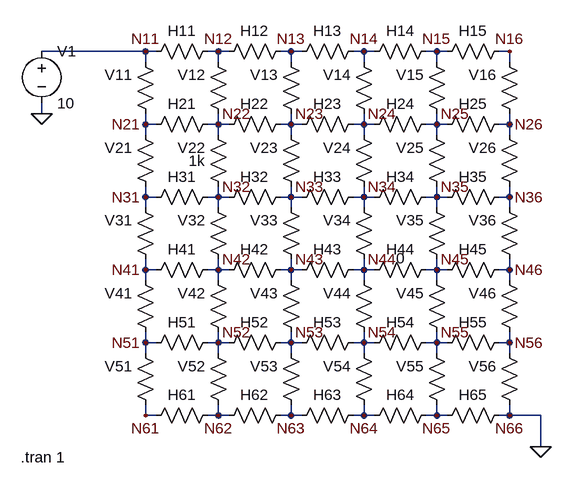
[diagram p0: schematic 6x6_grid.asc]
6x6_grid.asc, the LTspice schematic file:
Version 4
SHEET 1 880 732
WIRE -16 96 -176 96
WIRE 0 96 -16 96
WIRE 96 96 80 96
WIRE 112 96 96 96
WIRE 208 96 192 96
WIRE 224 96 208 96
WIRE 320 96 304 96
WIRE 336 96 320 96
WIRE 432 96 416 96
WIRE 448 96 432 96
WIRE 544 96 528 96
WIRE -16 112 -16 96
WIRE 96 112 96 96
WIRE 208 112 208 96
WIRE 320 112 320 96
WIRE 432 112 432 96
WIRE 544 112 544 96
WIRE -176 192 -176 176
WIRE -16 208 -16 192
WIRE 0 208 -16 208
WIRE 96 208 96 192
WIRE 96 208 80 208
WIRE 112 208 96 208
WIRE 208 208 208 192
WIRE 208 208 192 208
WIRE 224 208 208 208
WIRE 320 208 320 192
WIRE 320 208 304 208
WIRE 336 208 320 208
WIRE 432 208 432 192
WIRE 432 208 416 208
WIRE 448 208 432 208
WIRE 544 208 544 192
WIRE 544 208 528 208
WIRE -16 224 -16 208
WIRE 96 224 96 208
WIRE 208 224 208 208
WIRE 320 224 320 208
WIRE 432 224 432 208
WIRE 544 224 544 208
WIRE -16 320 -16 304
WIRE 0 320 -16 320
WIRE 96 320 96 304
WIRE 96 320 80 320
WIRE 112 320 96 320
WIRE 208 320 208 304
WIRE 208 320 192 320
WIRE 224 320 208 320
WIRE 320 320 320 304
WIRE 320 320 304 320
WIRE 336 320 320 320
WIRE 432 320 432 304
WIRE 432 320 416 320
WIRE 448 320 432 320
WIRE 544 320 544 304
WIRE 544 320 528 320
WIRE -16 336 -16 320
WIRE 96 336 96 320
WIRE 208 336 208 320
WIRE 320 336 320 320
WIRE 432 336 432 320
WIRE 544 336 544 320
WIRE -16 432 -16 416
WIRE 0 432 -16 432
WIRE 96 432 96 416
WIRE 96 432 80 432
WIRE 112 432 96 432
WIRE 208 432 208 416
WIRE 208 432 192 432
WIRE 224 432 208 432
WIRE 320 432 320 416
WIRE 320 432 304 432
WIRE 336 432 320 432
WIRE 432 432 432 416
WIRE 432 432 416 432
WIRE 448 432 432 432
WIRE 544 432 544 416
WIRE 544 432 528 432
WIRE -16 448 -16 432
WIRE 96 448 96 432
WIRE 208 448 208 432
WIRE 320 448 320 432
WIRE 432 448 432 432
WIRE 544 448 544 432
WIRE -16 544 -16 528
WIRE 0 544 -16 544
WIRE 96 544 96 528
WIRE 96 544 80 544
WIRE 112 544 96 544
WIRE 208 544 208 528
WIRE 208 544 192 544
WIRE 224 544 208 544
WIRE 320 544 320 528
WIRE 320 544 304 544
WIRE 336 544 320 544
WIRE 432 544 432 528
WIRE 432 544 416 544
WIRE 448 544 432 544
WIRE 544 544 544 528
WIRE 544 544 528 544
WIRE -16 560 -16 544
WIRE 96 560 96 544
WIRE 208 560 208 544
WIRE 320 560 320 544
WIRE 432 560 432 544
WIRE 544 560 544 544
WIRE -16 656 -16 640
WIRE 0 656 -16 656
WIRE 96 656 96 640
WIRE 96 656 80 656
WIRE 112 656 96 656
WIRE 208 656 208 640
WIRE 208 656 192 656
WIRE 224 656 208 656
WIRE 320 656 320 640
WIRE 320 656 304 656
WIRE 336 656 320 656
WIRE 432 656 432 640
WIRE 432 656 416 656
WIRE 448 656 432 656
WIRE 544 656 544 640
WIRE 544 656 528 656
WIRE 592 656 544 656
WIRE 592 704 592 656
FLAG -16 96 N11
FLAG 96 96 N12
FLAG 208 96 N13
FLAG 320 96 N14
FLAG -16 208 N21
FLAG 96 208 N22
FLAG 208 208 N23
FLAG 320 208 N24
FLAG -16 320 N31
FLAG 96 320 N32
FLAG 208 320 N33
FLAG 320 320 N34
FLAG -16 432 N41
FLAG -16 544 N51
FLAG -16 656 N61
FLAG 96 432 N42
FLAG 96 656 N62
FLAG 208 432 N43
FLAG 208 656 N63
FLAG 320 656 N64
FLAG 592 704 0
FLAG 432 96 N15
FLAG 544 96 N16
FLAG 432 208 N25
FLAG 544 208 N26
FLAG 432 320 N35
FLAG 544 320 N36
FLAG 320 432 N44
FLAG 432 432 N45
FLAG 544 432 N46
FLAG 432 544 N55
FLAG 544 544 N56
FLAG 432 656 N65
FLAG 544 656 N66
FLAG 96 544 N52
FLAG 208 544 N53
FLAG 320 544 N54
FLAG -176 192 0
SYMBOL res 96 80 R90
WINDOW 0 0 56 VBottom 2
WINDOW 3 20 56 Invisible 2
SYMATTR InstName H11
SYMATTR Value 1k
SYMBOL res 208 80 R90
WINDOW 0 0 56 VBottom 2
WINDOW 3 20 56 Invisible 2
SYMATTR InstName H12
SYMATTR Value 1k
SYMBOL res 320 80 R90
WINDOW 0 0 56 VBottom 2
WINDOW 3 20 56 Invisible 2
SYMATTR InstName H13
SYMATTR Value 1k
SYMBOL res 0 208 R180
WINDOW 0 36 76 Left 2
WINDOW 3 36 56 Invisible 2
SYMATTR InstName V11
SYMATTR Value 1k
SYMBOL res 112 208 R180
WINDOW 0 36 76 Left 2
WINDOW 3 36 56 Invisible 2
SYMATTR InstName V12
SYMATTR Value 1k
SYMBOL res 224 208 R180
WINDOW 0 36 76 Left 2
WINDOW 3 36 56 Invisible 2
SYMATTR InstName V13
SYMATTR Value 1k
SYMBOL res 336 208 R180
WINDOW 0 36 76 Left 2
WINDOW 3 36 56 Invisible 2
SYMATTR InstName V14
SYMATTR Value 1k
SYMBOL res 0 320 R180
WINDOW 0 36 76 Left 2
WINDOW 3 36 56 Invisible 2
SYMATTR InstName V21
SYMATTR Value 1k
SYMBOL res -16 336 R270
WINDOW 0 32 56 VTop 2
WINDOW 3 12 56 Invisible 2
SYMATTR InstName H31
SYMATTR Value 1k
SYMBOL res 96 336 R270
WINDOW 0 32 56 VTop 2
WINDOW 3 12 56 Invisible 2
SYMATTR InstName H32
SYMATTR Value 1k
SYMBOL res 208 336 R270
WINDOW 0 32 56 VTop 2
WINDOW 3 12 56 Invisible 2
SYMATTR InstName H33
SYMATTR Value 1k
SYMBOL res 96 192 R90
WINDOW 0 0 56 VBottom 2
WINDOW 3 20 56 Invisible 2
SYMATTR InstName H21
SYMATTR Value 1k
SYMBOL res 208 192 R90
WINDOW 0 0 56 VBottom 2
WINDOW 3 20 56 Invisible 2
SYMATTR InstName H22
SYMATTR Value 1K
SYMBOL res 320 192 R90
WINDOW 0 0 56 VBottom 2
WINDOW 3 20 56 Invisible 2
SYMATTR InstName H23
SYMATTR Value 1k
SYMBOL res 112 320 R180
WINDOW 0 36 76 Left 2
WINDOW 3 36 56 Left 2
SYMATTR InstName V22
SYMATTR Value 1k
SYMBOL res 224 320 R180
WINDOW 0 36 76 Left 2
WINDOW 3 36 56 Invisible 2
SYMATTR InstName V23
SYMATTR Value 1k
SYMBOL res 336 320 R180
WINDOW 0 36 76 Left 2
WINDOW 3 36 56 Invisible 2
SYMATTR InstName V24
SYMATTR Value 1k
SYMBOL res 112 432 R180
WINDOW 3 36 40 Invisible 2
WINDOW 0 36 76 Left 2
SYMATTR Value 1k
SYMATTR InstName V32
SYMBOL res 224 432 R180
WINDOW 3 36 40 Invisible 2
WINDOW 0 36 76 Left 2
SYMATTR Value 1K
SYMATTR InstName V33
SYMBOL res 336 432 R180
WINDOW 3 36 40 Invisible 2
WINDOW 0 36 76 Left 2
SYMATTR Value 1k
SYMATTR InstName V34
SYMBOL res 96 416 R90
WINDOW 0 0 56 VBottom 2
WINDOW 3 20 56 Invisible 2
SYMATTR InstName H41
SYMATTR Value 1k
SYMBOL res 208 416 R90
WINDOW 0 0 56 VBottom 2
WINDOW 3 20 56 Invisible 2
SYMATTR InstName H42
SYMATTR Value 1k
SYMBOL res 320 416 R90
WINDOW 0 0 56 VBottom 2
WINDOW 3 20 56 Invisible 2
SYMATTR InstName H43
SYMATTR Value 1K
SYMBOL voltage -176 80 R0
WINDOW 123 0 0 Left 0
WINDOW 39 0 0 Left 0
SYMATTR InstName V1
SYMATTR Value 10
SYMBOL res 0 432 R180
WINDOW 0 36 76 Left 2
WINDOW 3 36 56 Invisible 2
SYMATTR InstName V31
SYMATTR Value 1k
SYMBOL res 0 544 R180
WINDOW 0 36 76 Left 2
WINDOW 3 36 56 Invisible 2
SYMATTR InstName V41
SYMATTR Value 1k
SYMBOL res 0 656 R180
WINDOW 0 36 76 Left 2
WINDOW 3 36 56 Invisible 2
SYMATTR InstName V51
SYMATTR Value 1k
SYMBOL res 112 544 R180
WINDOW 0 36 76 Left 2
WINDOW 3 36 56 Invisible 2
SYMATTR InstName V42
SYMATTR Value 1k
SYMBOL res 112 656 R180
WINDOW 0 36 76 Left 2
WINDOW 3 36 56 Invisible 2
SYMATTR InstName V52
SYMATTR Value 1k
SYMBOL res 224 544 R180
WINDOW 0 36 76 Left 2
WINDOW 3 36 56 Invisible 2
SYMATTR InstName V43
SYMATTR Value 1k
SYMBOL res 224 656 R180
WINDOW 0 36 76 Left 2
WINDOW 3 36 56 Invisible 2
SYMATTR InstName V53
SYMATTR Value 1k
SYMBOL res 336 544 R180
WINDOW 0 36 76 Left 2
WINDOW 3 36 56 Invisible 2
SYMATTR InstName V44
SYMATTR Value 1k
SYMBOL res 336 656 R180
WINDOW 0 36 76 Left 2
WINDOW 3 36 56 Invisible 2
SYMATTR InstName V54
SYMATTR Value 1k
SYMBOL res 96 528 R90
WINDOW 0 0 56 VBottom 2
WINDOW 3 32 56 Invisible 2
SYMATTR InstName H51
SYMATTR Value 1K
SYMBOL res 208 528 R90
WINDOW 0 0 56 VBottom 2
WINDOW 3 32 56 Invisible 2
SYMATTR InstName H52
SYMATTR Value 1K
SYMBOL res 320 528 R90
WINDOW 0 0 56 VBottom 2
WINDOW 3 32 56 Invisible 2
SYMATTR InstName H53
SYMATTR Value 1K
SYMBOL res 96 640 R90
WINDOW 0 0 56 VBottom 2
WINDOW 3 32 56 Invisible 2
SYMATTR InstName H61
SYMATTR Value 1K
SYMBOL res 208 640 R90
WINDOW 0 0 56 VBottom 2
WINDOW 3 32 56 Invisible 2
SYMATTR InstName H62
SYMATTR Value 1K
SYMBOL res 320 640 R90
WINDOW 0 0 56 VBottom 2
WINDOW 3 32 56 Invisible 2
SYMATTR InstName H63
SYMATTR Value 1K
SYMBOL res 432 640 R90
WINDOW 0 0 56 VBottom 2
WINDOW 3 32 56 Invisible 2
SYMATTR InstName H64
SYMATTR Value 1K
SYMBOL res 432 528 R90
WINDOW 0 0 56 VBottom 2
WINDOW 3 32 56 Invisible 2
SYMATTR InstName H54
SYMATTR Value 1K
SYMBOL res 432 416 R90
WINDOW 0 0 56 VBottom 2
WINDOW 3 14 56 VBottom 2
SYMATTR InstName H44
SYMATTR Value 0
SYMBOL res 432 304 R90
WINDOW 0 0 56 VBottom 2
WINDOW 3 32 56 Invisible 2
SYMATTR InstName H34
SYMATTR Value 1K
SYMBOL res 432 192 R90
WINDOW 0 0 56 VBottom 2
WINDOW 3 32 56 Invisible 2
SYMATTR InstName H24
SYMATTR Value 1K
SYMBOL res 432 80 R90
WINDOW 0 0 56 VBottom 2
WINDOW 3 40 49 Invisible 2
SYMATTR InstName H14
SYMATTR Value 1K
SYMBOL res 448 208 R180
WINDOW 0 36 76 Left 2
WINDOW 3 36 40 Invisible 2
SYMATTR InstName V15
SYMATTR Value 1K
SYMBOL res 448 320 R180
WINDOW 0 36 76 Left 2
WINDOW 3 36 40 Invisible 2
SYMATTR InstName V25
SYMATTR Value 1K
SYMBOL res 448 432 R180
WINDOW 0 36 76 Left 2
WINDOW 3 36 40 Invisible 2
SYMATTR InstName V35
SYMATTR Value 1K
SYMBOL res 448 544 R180
WINDOW 0 36 76 Left 2
WINDOW 3 36 40 Invisible 2
SYMATTR InstName V45
SYMATTR Value 1K
SYMBOL res 448 656 R180
WINDOW 0 36 76 Left 2
WINDOW 3 36 40 Invisible 2
SYMATTR InstName V55
SYMATTR Value 1K
SYMBOL res 432 672 R270
WINDOW 0 32 56 VTop 2
WINDOW 3 0 56 Invisible 2
SYMATTR InstName H65
SYMATTR Value 1K
SYMBOL res 432 560 R270
WINDOW 0 32 56 VTop 2
WINDOW 3 0 56 Invisible 2
SYMATTR InstName H55
SYMATTR Value 1K
SYMBOL res 432 448 R270
WINDOW 0 32 56 VTop 2
WINDOW 3 0 56 Invisible 2
SYMATTR InstName H45
SYMATTR Value 1K
SYMBOL res 432 336 R270
WINDOW 0 32 56 VTop 2
WINDOW 3 0 56 Invisible 2
SYMATTR InstName H35
SYMATTR Value 1K
SYMBOL res 432 224 R270
WINDOW 0 32 56 VTop 2
WINDOW 3 0 56 Invisible 2
SYMATTR InstName H25
SYMATTR Value 1K
SYMBOL res 432 112 R270
WINDOW 0 32 56 VTop 2
WINDOW 3 0 56 Invisible 2
SYMATTR InstName H15
SYMATTR Value 1K
SYMBOL res 560 208 R180
WINDOW 0 36 76 Left 2
WINDOW 3 36 40 Invisible 2
SYMATTR InstName V16
SYMATTR Value 1K
SYMBOL res 560 320 R180
WINDOW 0 36 76 Left 2
WINDOW 3 36 40 Invisible 2
SYMATTR InstName V26
SYMATTR Value 1K
SYMBOL res 560 432 R180
WINDOW 0 36 76 Left 2
WINDOW 3 36 40 Invisible 2
SYMATTR InstName V36
SYMATTR Value 1K
SYMBOL res 560 544 R180
WINDOW 0 36 76 Left 2
WINDOW 3 36 40 Invisible 2
SYMATTR InstName V46
SYMATTR Value 1K
SYMBOL res 560 656 R180
WINDOW 0 36 76 Left 2
WINDOW 3 36 40 Invisible 2
SYMATTR InstName V56
SYMATTR Value 1K
TEXT -208 720 Left 2 !.tran 1

The netlist it stands for:
* 6x6_grid.asc
R§H11 N12 N11 1k
R§H12 N13 N12 1k
R§H13 N14 N13 1k
R§V11 N21 N11 1k
R§V12 N22 N12 1k
R§V13 N23 N13 1k
R§V14 N24 N14 1k
R§V21 N31 N21 1k
R§H31 N31 N32 1k
R§H32 N32 N33 1k
R§H33 N33 N34 1k
R§H21 N22 N21 1k
R§H22 N23 N22 1K
R§H23 N24 N23 1k
R§V22 N32 N22 1k
R§V23 N33 N23 1k
R§V24 N34 N24 1k
R§V32 N42 N32 1k
R§V33 N43 N33 1K
R§V34 N44 N34 1k
R§H41 N42 N41 1k
R§H42 N43 N42 1k
R§H43 N44 N43 1K
V1 N11 0 10
R§V31 N41 N31 1k
R§V41 N51 N41 1k
R§V51 N61 N51 1k
R§V42 N52 N42 1k
R§V52 N62 N52 1k
R§V43 N53 N43 1k
R§V53 N63 N53 1k
R§V44 N54 N44 1k
R§V54 N64 N54 1k
R§H51 N52 N51 1K
R§H52 N53 N52 1K
R§H53 N54 N53 1K
R§H61 N62 N61 1K
R§H62 N63 N62 1K
R§H63 N64 N63 1K
R§H64 N65 N64 1K
R§H54 N55 N54 1K
R§H44 N45 N44 0
R§H34 N35 N34 1K
R§H24 N25 N24 1K
R§H14 N15 N14 1K
R§V15 N25 N15 1K
R§V25 N35 N25 1K
R§V35 N45 N35 1K
R§V45 N55 N45 1K
R§V55 N65 N55 1K
R§H65 N65 0 1K
R§H55 N55 N56 1K
R§H45 N45 N46 1K
R§H35 N35 N36 1K
R§H25 N25 N26 1K
R§H15 N15 N16 1K
R§V16 N26 N16 1K
R§V26 N36 N26 1K
R§V36 N46 N36 1K
R§V46 N56 N46 1K
R§V56 0 N56 1K
.tran 1
.backanno
.end